# EasyEDA Pro project Water.epro

# Schematic Schematic1
Board Name: Board1; Create Date: 2026-02-25; Page Name: P1; Project Name: Water; Schematic Name: Schematic1; Update Date: 2026-02-25; Company: EasyEDA.com; Page Size: A4; Version: V1.0
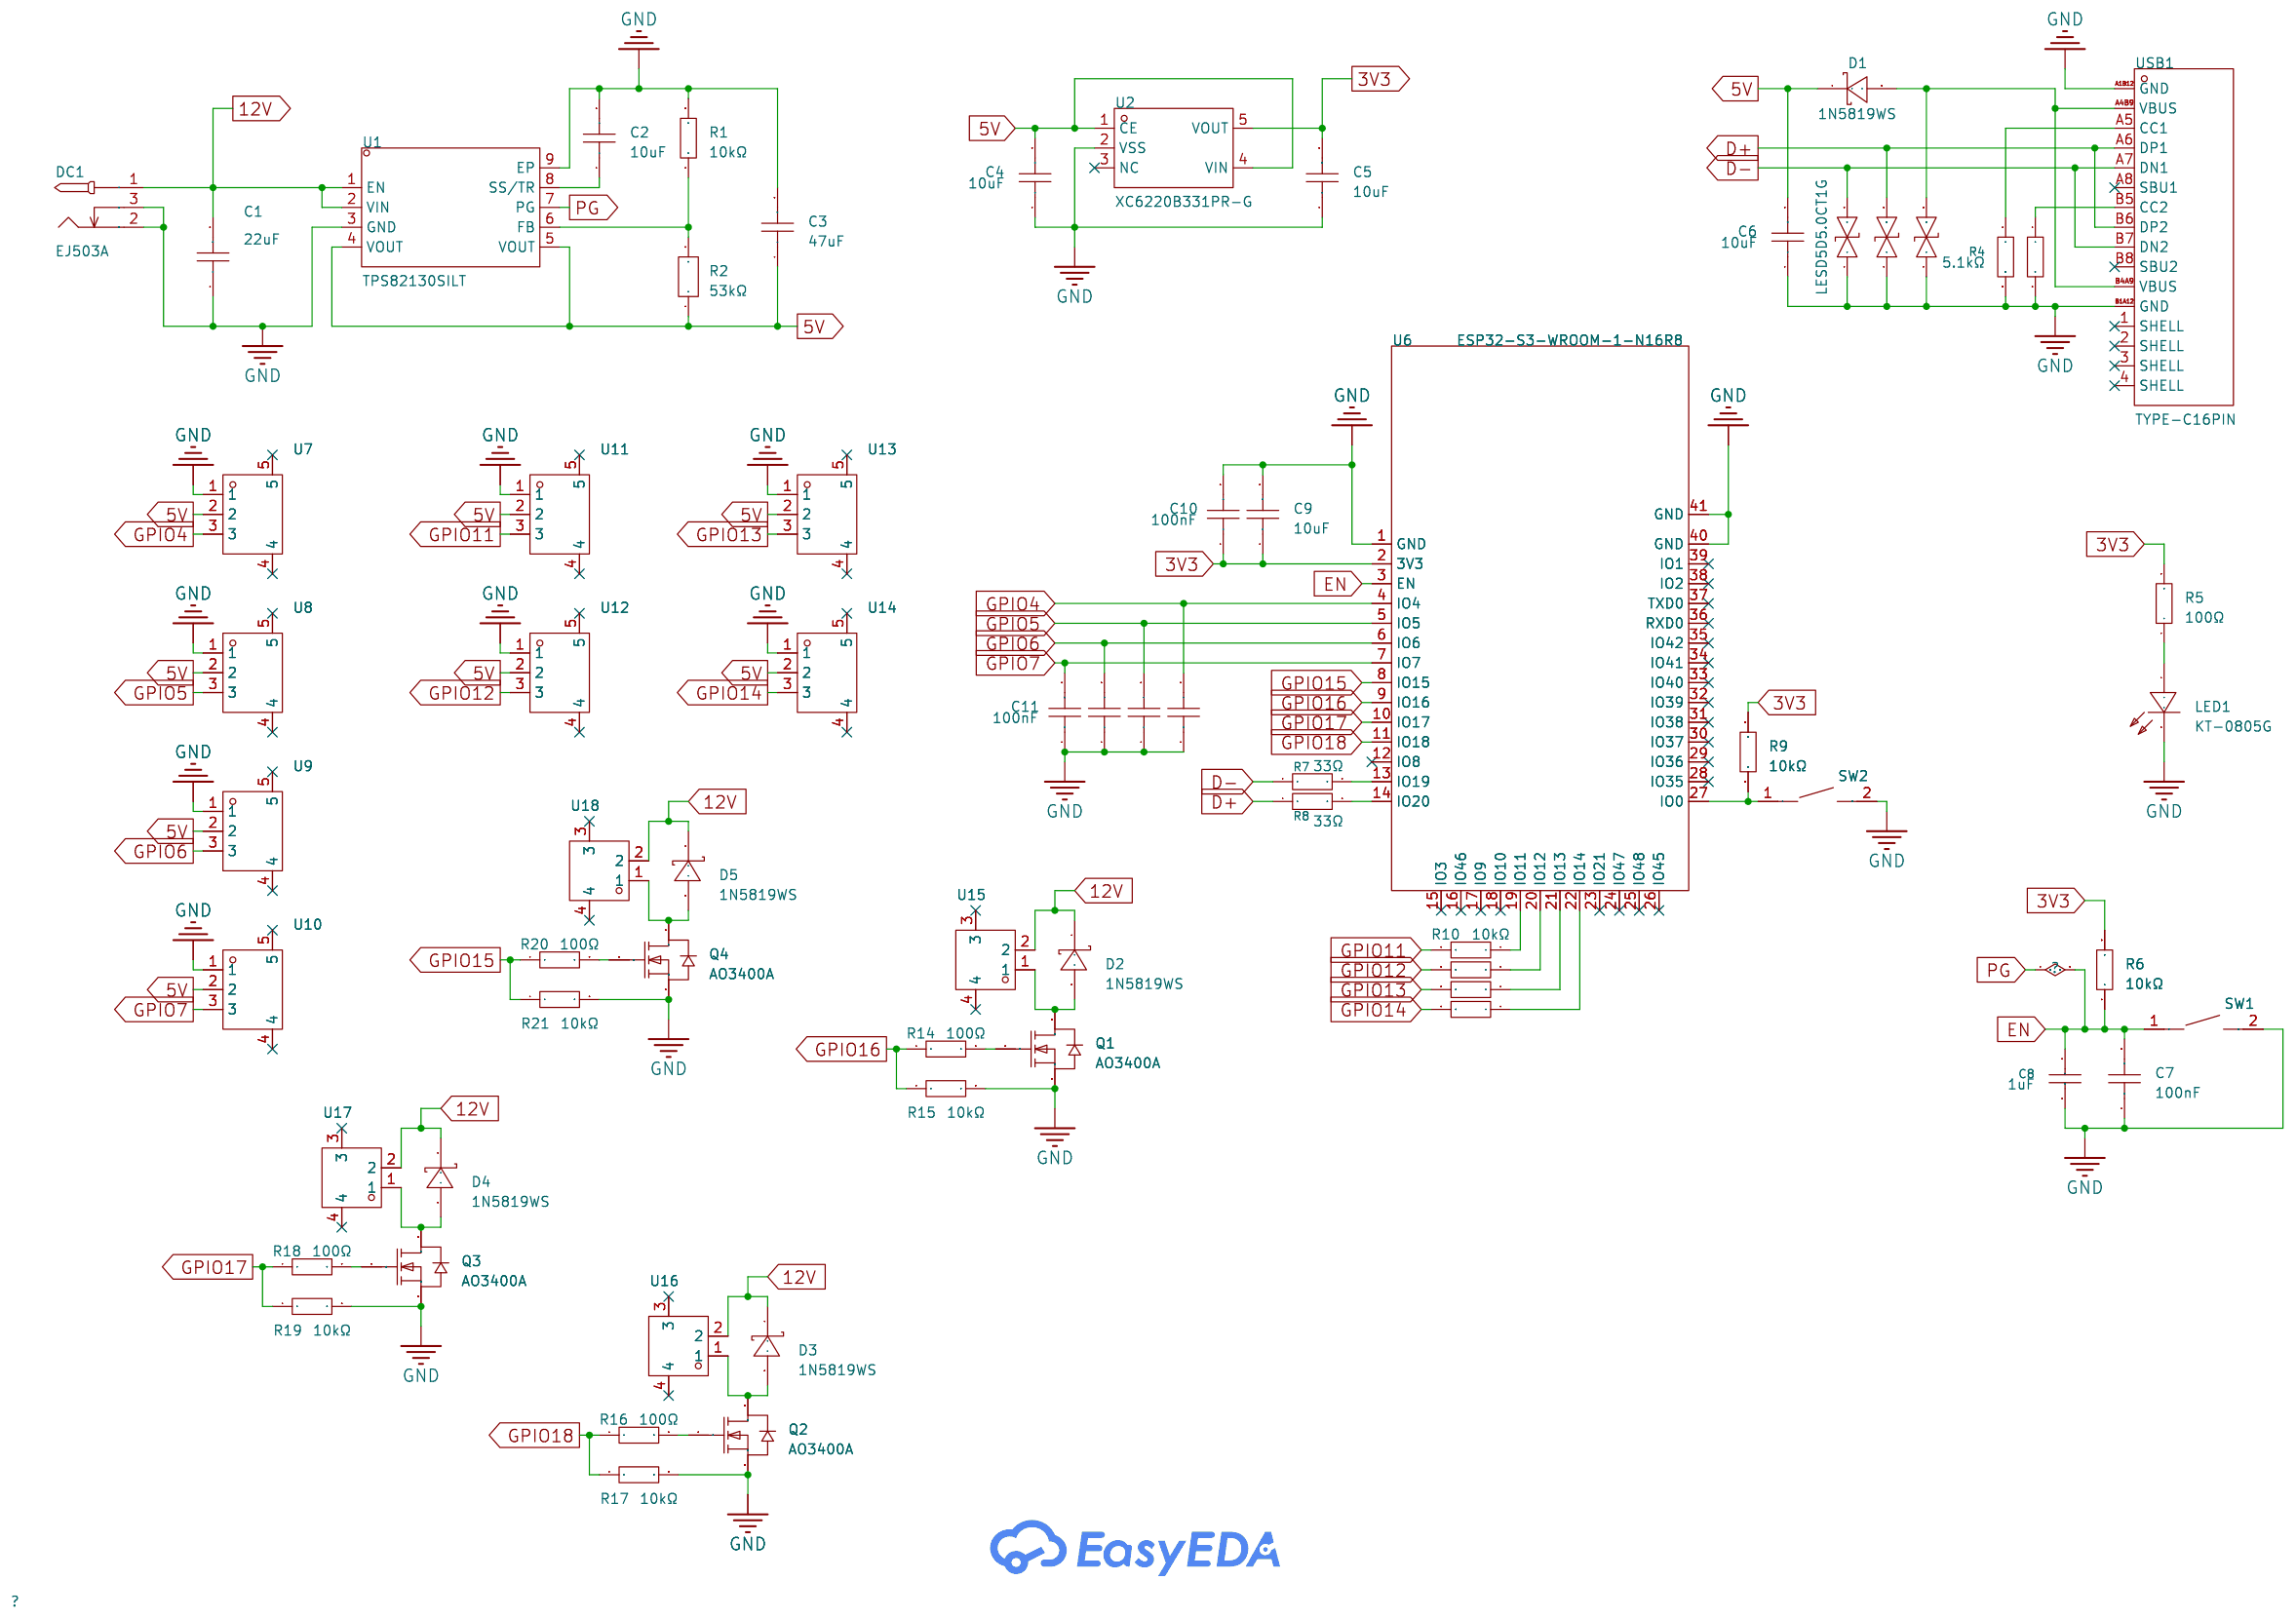
[diagram p0: schematic sheet]

## Parts
C1  22uF  [C1210]
C2  10uF  [C1210]
C3  47uF  [C1210]
C4  10uF  [C1210]
C5  10uF  [C1210]
C6  10uF  [C1210]
C7  100nF  [C0402]
C8  1uF  [C0805]
C9  10uF  [C1210]
C10  100nF  [C0402]
C11  100nF  [C0402]
C12  100nF  [C0402]
C13  100nF  [C0402]
C14  100nF  [C0402]
D1  1N5819WS  [SOD-323_L1.8-W1.3-LS2.5-RD]
D2  1N5819WS  [SOD-323_L1.8-W1.3-LS2.5-RD]
D3  1N5819WS  [SOD-323_L1.8-W1.3-LS2.5-RD]
D4  1N5819WS  [SOD-323_L1.8-W1.3-LS2.5-RD]
D5  1N5819WS  [SOD-323_L1.8-W1.3-LS2.5-RD]
DC1  EJ503A  [DC-IN-TH_EJ503A]
LED1  KT-0805G  [LED0805-R-RD]
Q1  AO3400A  [SOT-23-3_L2.9-W1.3-P1.90-LS2.4-BR]
Q2  AO3400A  [SOT-23-3_L2.9-W1.3-P1.90-LS2.4-BR]
Q3  AO3400A  [SOT-23-3_L2.9-W1.3-P1.90-LS2.4-BR]
Q4  AO3400A  [SOT-23-3_L2.9-W1.3-P1.90-LS2.4-BR]
R1  10kΩ  [R0402]
R2  53kΩ  [R0402]
R3  5.1kΩ  [R0402]
R4  5.1kΩ  [R0402]
R5  100Ω  [R0402]
R6  10kΩ  [R0402]
R7  33Ω  [R0402]
R8  33Ω  [R0402]
R9  10kΩ  [R0402]
R10  10kΩ  [R0402]
R11  10kΩ  [R0402]
R12  10kΩ  [R0402]
R13  10kΩ  [R0402]
R14  100Ω  [R0402]
R15  10kΩ  [R0402]
R16  100Ω  [R0402]
R17  10kΩ  [R0402]
R18  100Ω  [R0402]
R19  10kΩ  [R0402]
R20  100Ω  [R0402]
R21  10kΩ  [R0402]
SW1  TS-1088-AR02016  [SW-SMD_L3.9-W3.0-P4.45]
SW2  TS-1088-AR02016  [SW-SMD_L3.9-W3.0-P4.45]
U1  TPS82130SILT  [SIL-8_L3.0-W2.8-P0.65-BL-EP]
U2  XC6220B331PR-G  [SOT-89-5_L4.5-W2.5-P1.50-LS4.4-BR]
U3  LESD5D5.0CT1G  [SOD-523_L1.2-W0.8-LS1.6-BI]
U4  LESD5D5.0CT1G  [SOD-523_L1.2-W0.8-LS1.6-BI]
U5  LESD5D5.0CT1G  [SOD-523_L1.2-W0.8-LS1.6-BI]
U6  ESP32-S3-WROOM-1-N16R8  [WIRELM-SMD_ESP32-S3-WROOM-1]
U7  WAFER-PH2.0-3PLB  [CONN-SMD_3P-P2.00_XUNPU_WAFER-PH2.0-3PLB]
U8  WAFER-PH2.0-3PLB  [CONN-SMD_3P-P2.00_XUNPU_WAFER-PH2.0-3PLB]
U9  WAFER-PH2.0-3PLB  [CONN-SMD_3P-P2.00_XUNPU_WAFER-PH2.0-3PLB]
U10  WAFER-PH2.0-3PLB  [CONN-SMD_3P-P2.00_XUNPU_WAFER-PH2.0-3PLB]
U11  WAFER-PH2.0-3PLB  [CONN-SMD_3P-P2.00_XUNPU_WAFER-PH2.0-3PLB]
U12  WAFER-PH2.0-3PLB  [CONN-SMD_3P-P2.00_XUNPU_WAFER-PH2.0-3PLB]
U13  WAFER-PH2.0-3PLB  [CONN-SMD_3P-P2.00_XUNPU_WAFER-PH2.0-3PLB]
U14  WAFER-PH2.0-3PLB  [CONN-SMD_3P-P2.00_XUNPU_WAFER-PH2.0-3PLB]
U15  WAFER-PH2.0-2PLB  [CONN-TH_2P-P2.00_XUNPU_WAFER-PH2.0-2PLB]
U16  WAFER-PH2.0-2PLB  [CONN-TH_2P-P2.00_XUNPU_WAFER-PH2.0-2PLB]
U17  WAFER-PH2.0-2PLB  [CONN-TH_2P-P2.00_XUNPU_WAFER-PH2.0-2PLB]
U18  WAFER-PH2.0-2PLB  [CONN-TH_2P-P2.00_XUNPU_WAFER-PH2.0-2PLB]
USB1  TYPE-C16PIN  [USB-C-SMD_TYPE-C16PIN]

## Library data of the parts
C1 = CL32B226KAJNNNE: Capacitance:22uF Tolerance:±10% Tolerance:±10% Voltage Rating:25V Temperature Coefficient:X7R; LCSC Part Name: 22uF ±10% 25V; Supplier Part: C309062; Manufacturer: SAMSUNG(三星); Supplier Footprint: 1210; JLCPCB Part Class: Extended Part; Datasheet: https://item.szlcsc.com/datasheet/CL32B226KAJNNNE/292813.html; Supplier: LCSC; Tolerance: ±10%; Voltage Rating: 25V; Temperature Coefficient: X7R
C2 C4-C6 C9 = CL32Y106KCJ6PJE: Capacitance:10uF Tolerance:±10% Tolerance:±10% Voltage Rating:100V Temperature Coefficient:X7S; LCSC Part Name: 10uF ±10% 100V; Supplier Part: C22380041; Manufacturer: SAMSUNG(三星); Supplier Footprint: 1210; JLCPCB Part Class: Extended Part; Datasheet: https://item.szlcsc.com/datasheet/CL32Y106KCJ6PJE/23910233.html; Supplier: LCSC; Tolerance: ±10%; Voltage Rating: 100V; Temperature Coefficient: X7S
C3 = CL32B476KPJNNWE: Capacitance:47uF Tolerance:±10% Tolerance:±10% Voltage Rating:10V Temperature Coefficient:X7R; LCSC Part Name: 47uF ±10% 10V; Supplier Part: C2932479; Manufacturer: SAMSUNG(三星); Supplier Footprint: 1210; JLCPCB Part Class: Extended Part; Datasheet: https://item.szlcsc.com/datasheet/CL32B476KPJNNWE/3277792.html; Supplier: LCSC; Tolerance: ±10%; Voltage Rating: 10V; Temperature Coefficient: X7R
C7 C10-C14 = CL05B104KB54PNC: Capacitance:100nF Tolerance:±10% Tolerance:±10% Voltage Rating:50V Temperature Coefficient:X7R; LCSC Part Name: 100nF ±10% 50V; Supplier Part: C307331; Manufacturer: SAMSUNG(三星); Supplier Footprint: 0402; JLCPCB Part Class: Basic Part; Datasheet: https://item.szlcsc.com/datasheet/CL05B104KB54PNC/291005.html; Supplier: LCSC; Tolerance: ±10%; Voltage Rating: 50V; Temperature Coefficient: X7R
C8 = CL21B105KBFNNNE: Capacitance:1uF Tolerance:±10% Tolerance:±10% Voltage Rating:50V Temperature Coefficient:X7R; LCSC Part Name: 1uF ±10% 50V; Supplier Part: C28323; Manufacturer: SAMSUNG(三星); Supplier Footprint: 0805; JLCPCB Part Class: Basic Part; Datasheet: https://item.szlcsc.com/datasheet/CL21B105KBFNNNE/29074.html; Supplier: LCSC; Tolerance: ±10%; Voltage Rating: 50V; Temperature Coefficient: X7R
D1-D5 = 1N5819WS_C191023: Voltage - Forward(Vf@If):600mV@1A Voltage - DC Reverse(Vr):40V Current - Rectified:1A Non-Repetitive Peak Forward Surge Current:25A; LCSC Part Name: 电压:40V 电流:1A; Supplier Part: C191023; Manufacturer: Hottech(合科泰); Supplier Footprint: SOD-323; JLCPCB Part Class: Basic Part; Datasheet: https://item.szlcsc.com/datasheet/1N5819WS/213850.html; Supplier: LCSC; Voltage - Forward(Vf@If): 600mV@1A; Voltage - DC Reverse(Vr): 40V; Current - Rectified: 1A; Non-Repetitive Peak Forward Surge Current: 25A
DC1 = EJ503A: Inside Contact Diameter:2.1mm Outside Contact Diameter:5.5mm Current Rating:5A Voltage Rating (Max):12V Operating Temperature:-15℃~+90℃ Operating Temperature:-15℃~+90℃; LCSC Part Name: 内径:2.1mm 外径:5.5mm; Supplier Part: C3095117; Manufacturer: MPD(Memory Protection Devices); Supplier Footprint: 插件; JLCPCB Part Class: Extended Part; Datasheet: https://item.szlcsc.com/datasheet/EJ503A/3654351.html; Supplier: LCSC; Inside Contact Diameter: 2.1mm; Outside Contact Diameter: 5.5mm; Current Rating: 5A; Voltage Rating (Max): 12V; Operating Temperature: -15℃~+90℃
LED1 = KT-0805G: Lamp Holder Type:- Illumination Color:Emerald Green Voltage - Forward(Vf):2.6V~3.1V Voltage - Forward(Vf):2.6V~3.1V Power(Watts):100mW Forward Current:5mA Wavelength - Dominant:513nm~528nm Wavelength - Dominant:513nm~528nm Peak Wavelength:525nm Diode Conf; LCSC Part Name: 0805 翠绿 高亮; Supplier Part: C2297; Manufacturer: KENTO; Supplier Footprint: 0805; JLCPCB Part Class: Basic Part; Datasheet: https://item.szlcsc.com/datasheet/KT-0805G/2670.html; Supplier: LCSC; Illumination Color: Emerald Green; Voltage - Forward(Vf): 2.6V~3.1V; Power(Watts): 100mW; Forward Current: 5mA; Wavelength - Dominant: 513nm~528nm; Peak Wavelength: 525nm; Luminous Intensity: 430mcd; Viewing Angle: 120°; Operating Temperature: -40℃~+85℃
Q1-Q4 = AO3400A_C20917: Number:- Drain to Source Voltage:30V Current - Continuous Drain(Id):- RDS(on):48mΩ@2.5V Pd - Power Dissipation:- Gate Threshold Voltage (Vgs(th)):1.45V@250uA Gate Charge(Qg):7nC@10V Input Capacitance(Ciss):630pF@15V Reverse Transfer Capacitance (Crss@Vds); LCSC Part Name: 1个N沟道 耐压:30V 电流:5.7A; Supplier Part: C20917; Manufacturer: AOS; Supplier Footprint: SOT-23-3L; JLCPCB Part Class: Basic Part; Datasheet: https://item.szlcsc.com/datasheet/AO3400A/21629.html; Supplier: LCSC; Drain to Source Voltage: 30V; RDS(on): 48mΩ@2.5V; Gate Threshold Voltage (Vgs(th)): 1.45V@250uA; Gate Charge(Qg): 7nC@10V; Input Capacitance(Ciss): 630pF@15V; Operating Temperature: -55℃~+150℃@(Tj); Type: N-Channel
R1 R6 R9-R13 R15 R17 R19 R21 = 0402WGF1002TCE: Type:Thick Film Resistor Resistance:10kΩ Tolerance:±1% Tolerance:±1% Power(Watts):62.5mW Voltage-Supply(Max):50V Temperature Coefficient:±100ppm/℃ Temperature Coefficient:±100ppm/℃ Operating Temperature:-55℃~+155℃ Operating Temperature:-55℃~+155℃; LCSC Part Name: 10kΩ ±1% 62.5mW 厚膜电阻; Supplier Part: C25744; Manufacturer: UNI-ROYAL(厚声); Supplier Footprint: 0402; JLCPCB Part Class: Basic Part; Datasheet: https://item.szlcsc.com/datasheet/0402WGF1002TCE/26487.html; Supplier: LCSC; Type: Thick Film Resistor; Tolerance: ±1%; Power(Watts): 62.5mW; Voltage-Supply(Max): 50V; Temperature Coefficient: ±100ppm/℃; Operating Temperature: -55℃~+155℃
R2 = RT0402BRD0753KL: Type:Thin Film Resistor Resistance:53kΩ Tolerance:±0.1% Tolerance:±0.1% Power(Watts):62.5mW Temperature Coefficient:±25ppm/℃ Temperature Coefficient:±25ppm/℃ Operating Temperature:-55℃~+155℃ Operating Temperature:-55℃~+155℃; LCSC Part Name: 薄膜电阻 53kΩ ±0.1% 62.5mW; Supplier Part: C852836; Manufacturer: YAGEO(国巨); Supplier Footprint: 0402; JLCPCB Part Class: Extended Part; Datasheet: https://item.szlcsc.com/datasheet/RT0402BRD0753KL/913158.html; Supplier: LCSC; Type: Thin Film Resistor; Tolerance: ±0.1%; Power(Watts): 62.5mW; Temperature Coefficient: ±25ppm/℃; Operating Temperature: -55℃~+155℃
R3 R4 = 0402WGF5101TCE: Type:Thick Film Resistor Resistance:5.1kΩ Tolerance:±1% Tolerance:±1% Power(Watts):62.5mW Voltage-Supply(Max):50V Temperature Coefficient:±100ppm/℃ Temperature Coefficient:±100ppm/℃ Operating Temperature:-55℃~+155℃ Operating Temperature:-55℃~+155℃; LCSC Part Name: 5.1kΩ ±1% 62.5mW 厚膜电阻; Supplier Part: C25905; Manufacturer: UNI-ROYAL(厚声); Supplier Footprint: 0402; JLCPCB Part Class: Basic Part; Datasheet: https://item.szlcsc.com/datasheet/0402WGF5101TCE/26648.html; Supplier: LCSC; Type: Thick Film Resistor; Tolerance: ±1%; Power(Watts): 62.5mW; Voltage-Supply(Max): 50V; Temperature Coefficient: ±100ppm/℃; Operating Temperature: -55℃~+155℃
R5 R14 R16 R18 R20 = 0402WGF1000TCE: Type:Thick Film Resistors Resistance: Tolerance:±1% Tolerance:±1% Power(Watts): Overload Voltage (Max): Temperature Coefficient:±200ppm/℃ Temperature Coefficient:±200ppm/℃ Operating Temperature Range:-55℃~+155℃ Operating Temperature Range:-55℃~+155℃; LCSC Part Name: 100Ω ±1% 62.5mW 厚膜电阻; Supplier Part: C25076; Manufacturer: UNI-ROYAL(厚声); Supplier Footprint: 0402; JLCPCB Part Class: Basic Part; Datasheet: https://atta.szlcsc.com/upload/public/pdf/source/20200306/C422600_1E6D84923E4A46A82E41ADD87F860B5C.pdf; Supplier: LCSC; Type: Thick Film Resistors; Tolerance: ±1%; Temperature Coefficient: ±200ppm/℃; Operating Temperature Range: -55℃~+155℃
R7 R8 = 0402WGF330JTCE: Type:Thick Film Resistor Resistance:33Ω Tolerance:±1% Tolerance:±1% Power(Watts):62.5mW Voltage-Supply(Max):50V Temperature Coefficient:±100ppm/℃ Temperature Coefficient:±100ppm/℃ Operating Temperature:-55℃~+155℃ Operating Temperature:-55℃~+155℃; LCSC Part Name: 33Ω ±1% 62.5mW 厚膜电阻; Supplier Part: C25105; Manufacturer: UNI-ROYAL(厚声); Supplier Footprint: 0402; JLCPCB Part Class: Basic Part; Datasheet: https://item.szlcsc.com/datasheet/0402WGF330JTCE/25848.html; Supplier: LCSC; Type: Thick Film Resistor; Tolerance: ±1%; Power(Watts): 62.5mW; Voltage-Supply(Max): 50V; Temperature Coefficient: ±100ppm/℃; Operating Temperature: -55℃~+155℃
SW1 SW2 = TS-1088-AR02016: Circuit:SPST Actuator Style:Round Button Operating Force:1.6N Mounting Type:Surface Mount,Vertical Length:4mm Width:3mm Switch Height:2mm with Bracket:Without Bracket Contact Current:50mA Voltage Rating:12V Actuator/Cap Color:Black Termination Style:SMD(S; LCSC Part Name: 4*3*2mm 立贴 轻触开关; Supplier Part: C720477; Manufacturer: XUNPU(讯普); Supplier Footprint: SMD,4x3mm; JLCPCB Part Class: Basic Part; Datasheet: https://item.szlcsc.com/datasheet/TS-1088-AR02016/763484.html; Supplier: LCSC; Circuit: SPST; Actuator Style: Round Button; Operating Force: 1.6N; Mounting Type: Surface Mount,Vertical; Length: 4mm; Width: 3mm; Switch Height: 2mm; with Bracket: Without Bracket; Contact Current: 50mA; Voltage Rating: 12V; Actuator/Cap Color: Black; Termination Style: SMD(SMT) Tab; Life: 100,000 Cycles; Operating Temperature: -30℃~+80℃
U1 = TPS82130SILT: Function:Buck Number of Outputs:1 Voltage - Supply:3V~17V Voltage - Supply:3V~17V Output Voltage:900mV~6V Output Voltage:900mV~6V Output Current(Max):3A Output Current(Max):3A Quiescent Supply Current:20uA Switching Frequency:2MHz Ripple Noise:20mVp-p Fea; LCSC Part Name: 17V输入、3A降压转换器MicroSiP模块; Supplier Part: C163210; Manufacturer: TI(德州仪器); Supplier Footprint: SMD-8; JLCPCB Part Class: Extended Part; Datasheet: https://www.ti.com/cn/lit/gpn/tps82130; Supplier: LCSC; Function: Buck; Number of Outputs: 1; Voltage - Supply: 3V~17V; Output Voltage: 900mV~6V; Output Current(Max): 3A; Quiescent Supply Current: 20uA; Switching Frequency: 2MHz; Ripple Noise: 20mVp-p; Features: Over Temperature Protection; Length: 3mm; Width: 2.8mm; Height: 1.5mm; Operating Temperature Range: -40℃~+125℃
U2 = XC6220B331PR-G: Output Type:Fixed Voltage - Supply:6V Output Voltage:3.3V Output Voltage:3.3V Output Current:1A Power Supply Rejection Ratio (PSRR):50dB@(1kHz) Voltage Dropout:655mV@(1A) standby current:18uA Features:Surge Protection；Short-Circuit  Protection；Automatic D; LCSC Part Name: 带\"GO\"功能的1A高速LDO电压稳压器; Supplier Part: C3013658; Manufacturer: TOREX(特瑞仕); Supplier Footprint: SOT-89-5; JLCPCB Part Class: Extended Part; Datasheet: https://atta.szlcsc.com/upload/public/pdf/source/20220511/F1132B42A1D8E465E8536D59E138453A.pdf; Supplier: LCSC; Output Type: Fixed; Voltage - Supply: 6V; Output Voltage: 3.3V; Output Current: 1A; Power Supply Rejection Ratio (PSRR): 50dB@(1kHz); Voltage Dropout: 655mV@(1A); standby current: 18uA; Features: Surge Protection；Short-Circuit  Protection；Automatic Discharge Function；Low ESR；Thermal Protection(TSD)；Overcurrent Protection(OCP)；With ability; Operating Temperature: -40℃~+85℃; Output Configuration: Positive electrode; Number of Outputs: 1
U3-U5 = LESD5D5.0CT1G_C5246195: Supplier Part: C5246195; Manufacturer: Leiditech(雷卯电子); Supplier Footprint: SOD-523; JLCPCB Part Class: Extended Part; Datasheet: https://atta.szlcsc.com/upload/public/pdf/source/20221108/1C42B36F7D16189BC2911DA9C8277455.pdf; Supplier: LCSC
U6 = ESP32-S3-WROOM-1-N16R8: LCSC Part Name: 通用型Wi-Fi+低功耗蓝牙MCU模组; Supplier Part: C2913202; Manufacturer: ESPRESSIF(乐鑫); Supplier Footprint: SMD,25.5x18mm; JLCPCB Part Class: Extended Part; Datasheet: https://item.szlcsc.com/datasheet/ESP32-S3-WROOM-1-N16R8/3198300.html; Supplier: LCSC
U7-U14 = WAFER-PH2.0-3PLB: Pins Structure:1x3P Pitch:2mm Mounting Type:Surface Mount,Vertical Reference Series:PH Number of Pins:3P Number of Rows:1 Number of PINs Per Row:3 Row Spacing:- Current Rating:2A Contact Material:Brass Contact Plating:Tin Operating Temperature:-25℃~+85℃ O; LCSC Part Name: 1x3P 间距:2mm 立贴 系列:PH; Supplier Part: C3029432; Manufacturer: XUNPU(讯普); Supplier Footprint: SMD,P=2mm; JLCPCB Part Class: Extended Part; Datasheet: https://item.szlcsc.com/datasheet/WAFER-PH2.0-3PLB/3561444.html; Supplier: LCSC; Pins Structure: 1x3P; Pitch: 2mm; Mounting Type: Surface Mount,Vertical; Reference Series: PH; Number of Pins: 3P; Number of Rows: 1; Number of PINs Per Row: 3; Current Rating: 2A; Contact Material: Brass; Contact Plating: Tin; Operating Temperature: -25℃~+85℃; Voltage Rating: 250V; Plastic Material: LCP; Supplementary Features: Auxiliary Solder Pin; Color: Beige; Z-Height of the Board: 6.2mm; X-Length of Bottom Edge on Board (Spacing Line): 10mm; Y-Width of Bottom Edge on Board: 5.45mm
U15-U18 = WAFER-PH2.0-2PLB: Pins Structure:1x2P Pitch:2mm Mounting Type:Surface Mount,Vertical Reference Series:PH Number of Pins:2P Number of Rows:1 Number of PINs Per Row:2 Row Spacing:- Current Rating:2A Contact Material:Brass Contact Plating:Tin Operating Temperature:-25℃~+85℃ O; LCSC Part Name: 1x2P 间距:2mm 立贴 系列:PH; Supplier Part: C3029431; Manufacturer: XUNPU(讯普); Supplier Footprint: SMD,P=2mm; JLCPCB Part Class: Extended Part; Datasheet: https://item.szlcsc.com/datasheet/WAFER-PH2.0-2PLB/3561443.html; Supplier: LCSC; Pins Structure: 1x2P; Pitch: 2mm; Mounting Type: Surface Mount,Vertical; Reference Series: PH; Number of Pins: 2P; Number of Rows: 1; Number of PINs Per Row: 2; Current Rating: 2A; Contact Material: Brass; Contact Plating: Tin; Operating Temperature: -25℃~+85℃; Voltage Rating: 250V; Plastic Material: LCP; Supplementary Features: Auxiliary Solder Pin; Color: Beige; Z-Height of the Board: 6.2mm; X-Length of Bottom Edge on Board (Spacing Line): 8mm; Y-Width of Bottom Edge on Board: 5.45mm
USB1 = TYPE-C16PIN: Connector Type:Type-C Protocol Standard:- Gender:Female Mounting Type:Surface Mount, Right Angle Number of Contacts:16P Number of Ports:1 Current Rating-Power:3A Voltage Rating:30V Connect-Disconnect Life:10,000 Cycles Supplementary Features:- Center Heig; LCSC Part Name: 16P卧贴母座; Supplier Part: C393939; Manufacturer: SHOU HAN(首韩); Supplier Footprint: SMD; JLCPCB Part Class: Extended Part; Datasheet: https://item.szlcsc.com/datasheet/TYPE-C16PIN/372551.html; Supplier: LCSC; Connector Type: Type-C; Gender: Female; Mounting Type: Surface Mount, Right Angle; Number of Contacts: 16P; Number of Ports: 1; Current Rating-Power: 3A; Voltage Rating: 30V; Connect-Disconnect Life: 10,000 Cycles; Detection color: Black; Operating Temperature: -40℃~+85℃

## Nets
3V3: C5.2 C9.1 C10.1 R5.2 R6.2 R9.2 U2.5(VOUT) U6.2(3V3)
5V: C3.1 C4.2 C6.2 D1.1(K) R2.1 U1.4(VOUT) U1.5(VOUT) U2.1(CE) U2.4(VIN) U7.2 U8.2 U9.2 U10.2 U11.2 U12.2 U13.2 U14.2
12V: C1.2 D2.1(K) D3.1(K) D4.1(K) D5.1(K) DC1.1 U1.1(EN) U1.2(VIN) U15.2 U16.2 U17.2 U18.2
GND: C1.1 C2.2 C3.2 C4.1 C5.1 C6.1 C7.1 C8.1 C9.2 C10.2 C11.1 C12.1 C13.1 C14.1 DC1.2 DC1.3 LED1.2(K) Q1.2(S) Q2.2(S) Q3.2(S) Q4.2(S) R1.2 R3.2 R4.2 R15.2 R17.2 R19.2 R21.2 SW1.2 SW2.2 U1.3(GND) U1.9(EP) U2.2(VSS) U3.1 U4.1 U5.1 U6.1(GND) U6.40(GND) U6.41(GND) U7.1 U8.1 U9.1 U10.1 U11.1 U12.1 U13.1 U14.1 USB1.A1B12(GND) USB1.B1A12(GND)
D+: R8.1 U4.2 USB1.A6(DP1) USB1.B6(DP2)
D-: R7.1 U5.2 USB1.A7(DN1) USB1.B7(DN2)
EN: C7.2 C8.2 R6.1 SW1.1 U1.7(PG) U6.3(EN)
GPIO4: C14.2 U6.4(IO4) U7.3
GPIO5: C13.2 U6.5(IO5) U8.3
GPIO6: C12.2 U6.6(IO6) U9.3
GPIO7: C11.2 U6.7(IO7) U10.3
GPIO11: R10.2 U11.3
GPIO12: R11.2 U12.3
GPIO13: R12.2 U13.3
GPIO14: R13.2 U14.3
GPIO15: R20.1 R21.1 U6.8(IO15)
GPIO16: R14.1 R15.1 U6.9(IO16)
GPIO17: R18.1 R19.1 U6.10(IO17)
GPIO18: R16.1 R17.1 U6.11(IO18)
$1N755: C2.1 U1.8(SS/TR)
$1N917: R1.1 R2.2 U1.6(FB)
$1N2096: R3.1 USB1.B5(CC2)
$1N2140: R4.1 USB1.A5(CC1)
$1N2406: D1.2(A) U3.2 USB1.A4B9(VBUS) USB1.B4A9(VBUS)
$1N2868: LED1.1(A) R5.1
$1N3816: R8.2 U6.14(IO20)
$1N3820: R7.2 U6.13(IO19)
$1N4148: R9.1 SW2.1 U6.27(IO0)
$1N4709: R10.1 U6.19(IO11)
$1N4843: R11.1 U6.20(IO12)
$1N4849: R12.1 U6.21(IO13)
$1N4855: R13.1 U6.22(IO14)
$1N6055: D2.2(A) Q1.3(D) U15.1
$1N6201: Q1.1(G) R14.2
$1N6555: D3.2(A) Q2.3(D) U16.1
$1N6563: Q2.1(G) R16.2
$1N7088: D4.2(A) Q3.3(D) U17.1
$1N7096: Q3.1(G) R18.2
$1N7356: D5.2(A) Q4.3(D) U18.1
$1N7364: Q4.1(G) R20.2

Not connected (* = marked no-connect by the designer): U2 3(NC)*; U6 12(IO8)* 15(IO3)* 16(IO46)* 17(IO9)* 18(IO10)* 23(IO21)* 24(IO47)* 25(IO48)* 26(IO45)* 28(IO35)* 29(IO36)* 30(IO37)* 31(IO38)* 32(IO39)* 33(IO40)* 34(IO41)* 35(IO42)* 36(RXD0)* 37(TXD0)* 38(IO2)* 39(IO1)*; U7 4* 5*; U8 4* 5*; U9 4* 5*; U10 4* 5*; U11 4* 5*; U12 4* 5*; U13 4* 5*; U14 4* 5*; U15 3* 4*; U16 3* 4*; U17 3* 4*; U18 3* 4*; USB1 1(SHELL)* 2(SHELL)* 3(SHELL)* 4(SHELL)* A8(SBU1)* B8(SBU2)*

# Board PCB1
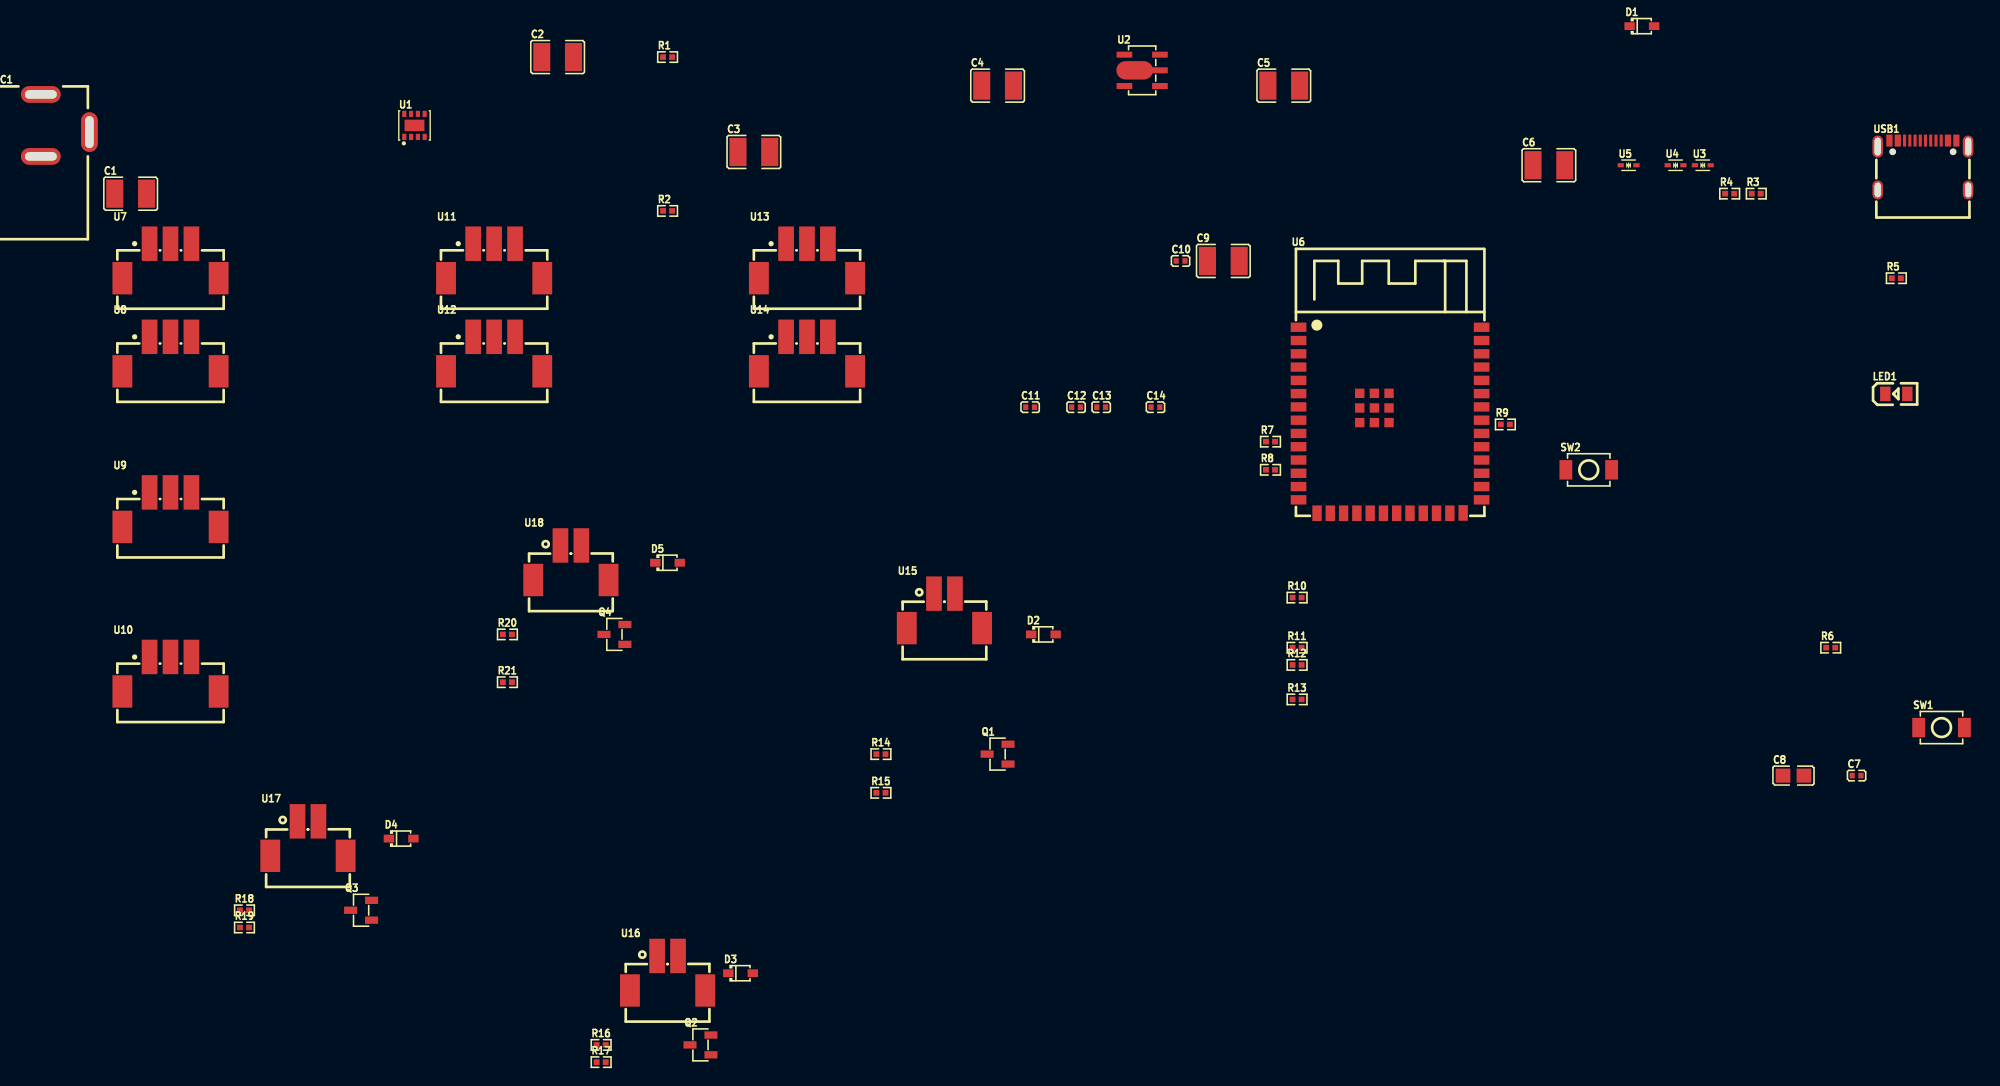
[diagram p1: board, top side]
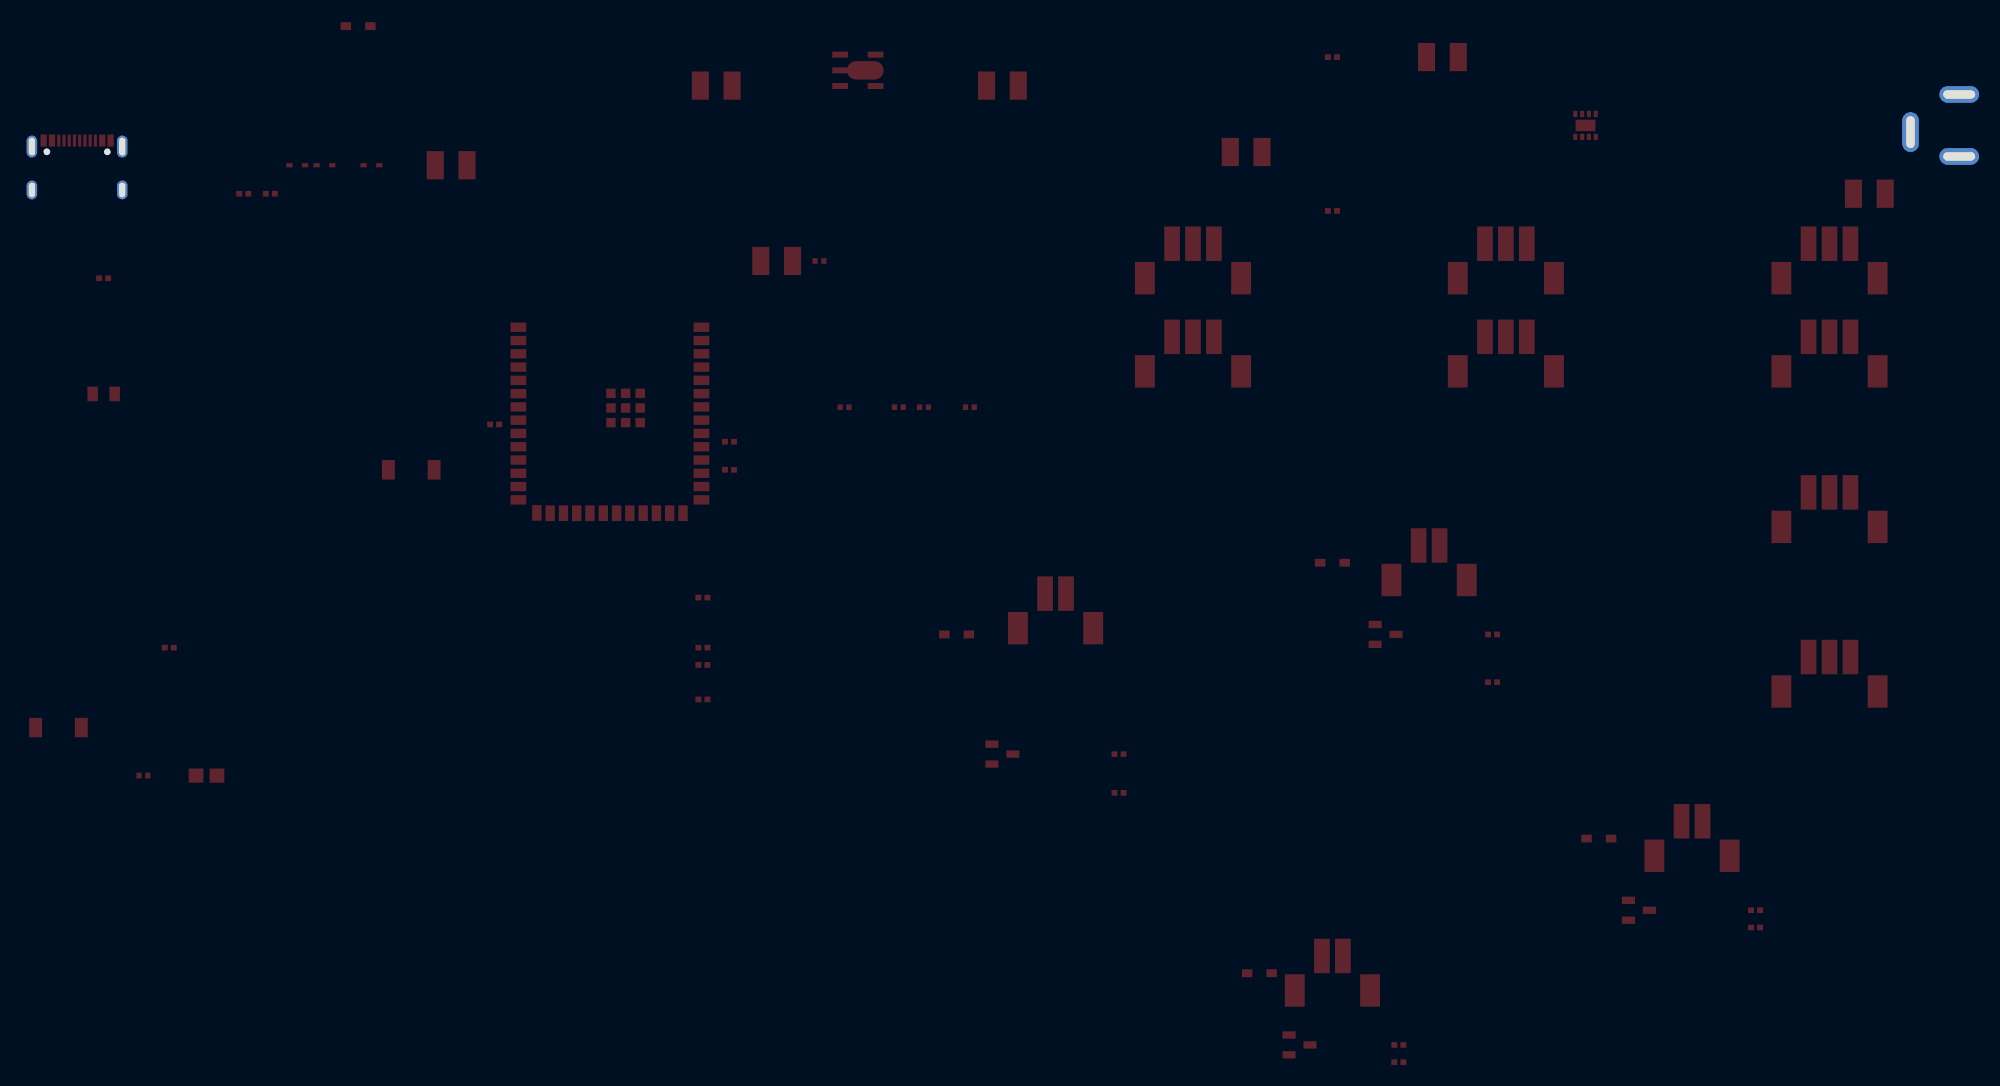
[diagram p2: board, bottom side, seen from below]

Outline 6.42 x 0.64 mm; copper layers: Top Layer, Bottom Layer. Coordinates in mm from the lower left corner of the outline.
Stack: Top Layer 0.035mm / Dielectric1 1.51mm FR4 er 4.5 / Bottom Layer 0.035mm

## Design rules (mm)
template: JLCPCB Capability(Two Layers Board)
spacing copperThickness1oz (default): track to track 0.102, other pairs 0.152 to 0.3
spacing copperThickness2oz: track to track 0.203, other pairs 0.152 to 0.3
track width copperThickness1oz (default): min 0.127, default 0.254, max 2.54
track width copperThickness2oz: min 0.203, default 0.254, max 2.54
differential pair differentialPair (default): width min 0.127, default 0.254, max 2.54; gap min 0.152, default 0.152
via viaSize (default): diameter min 0.5, default 0.61, max 10; hole min 0.3, default 0.305, max 6.3

## Placement (name value [footprint] x y rotation side)
C1  22uF  [C1210]  -168.12 -3.69 0 top
C2  10uF  [C1210]  -127.3 9.38 0 top
C3  47uF  [C1210]  -108.55 0.3 0 top
C4  10uF  [C1210]  -85.24 6.65 0 top
C5  10uF  [C1210]  -57.88 6.65 0 top
C6  10uF  [C1210]  -32.54 -0.97 0 top
C7  100nF  [C0402]  -3.13 -59.35 0 top
C8  1uF  [C0805]  -9.16 -59.35 0 top
C9  10uF  [C1210]  -63.66 -10.12 0 top
C10  100nF  [C0402]  -67.75 -10.12 0 top
C11  100nF  [C0402]  -82.13 -24.11 0 top
C12  100nF  [C0402]  -77.74 -24.11 0 top
C13  100nF  [C0402]  -75.34 -24.11 0 top
C14  100nF  [C0402]  -70.15 -24.11 0 top
D1  1N5819WS  [SOD-323_L1.8-W1.3-LS2.5-RD]  -23.65 12.34 0 top
D2  1N5819WS  [SOD-323_L1.8-W1.3-LS2.5-RD]  -80.86 -45.85 0 top
D3  1N5819WS  [SOD-323_L1.8-W1.3-LS2.5-RD]  -109.82 -78.26 0 top
D4  1N5819WS  [SOD-323_L1.8-W1.3-LS2.5-RD]  -142.26 -65.38 0 top
D5  1N5819WS  [SOD-323_L1.8-W1.3-LS2.5-RD]  -116.79 -38.99 0 top
DC1  EJ503A  [DC-IN-TH_EJ503A]  -174.39 2.84 0 top
LED1  KT-0805G  [LED0805-R-RD]  0.67 -22.84 0 top
Q1  AO3400A  [SOT-23-3_L2.9-W1.3-P1.90-LS2.4-BR]  -85.24 -57.3 0 top
Q2  AO3400A  [SOT-23-3_L2.9-W1.3-P1.90-LS2.4-BR]  -113.65 -85.12 0 top
Q3  AO3400A  [SOT-23-3_L2.9-W1.3-P1.90-LS2.4-BR]  -146.09 -72.24 0 top
Q4  AO3400A  [SOT-23-3_L2.9-W1.3-P1.90-LS2.4-BR]  -121.87 -45.85 0 top
R1  10kΩ  [R0402]  -116.79 9.38 0 top
R2  53kΩ  [R0402]  -116.79 -5.33 0 top
R3  5.1kΩ  [R0402]  -12.72 -3.69 0 top
R4  5.1kΩ  [R0402]  -15.26 -3.69 0 top
R5  100Ω  [R0402]  0.67 -11.77 0 top
R6  10kΩ  [R0402]  -5.6 -47.12 0 top
R7  33Ω  [R0402]  -59.15 -27.41 0 top
R8  33Ω  [R0402]  -59.15 -30.1 0 top
R9  10kΩ  [R0402]  -36.7 -25.76 0 top
R10  10kΩ  [R0402]  -56.61 -42.33 0 top
R11  10kΩ  [R0402]  -56.61 -47.12 0 top
R12  10kΩ  [R0402]  -56.61 -48.77 0 top
R13  10kΩ  [R0402]  -56.61 -52.07 0 top
R14  100Ω  [R0402]  -96.39 -57.3 0 top
R15  10kΩ  [R0402]  -96.39 -61 0 top
R16  100Ω  [R0402]  -123.14 -85.12 0 top
R17  10kΩ  [R0402]  -123.14 -86.77 0 top
R18  100Ω  [R0402]  -157.24 -72.24 0 top
R19  10kΩ  [R0402]  -157.24 -73.89 0 top
R20  100Ω  [R0402]  -132.1 -45.85 0 top
R21  10kΩ  [R0402]  -132.1 -50.42 0 top
SW1  TS-1088-AR02016  [SW-SMD_L3.9-W3.0-P4.45]  4.99 -54.76 0 top
SW2  TS-1088-AR02016  [SW-SMD_L3.9-W3.0-P4.45]  -28.73 -30.1 0 top
U1  TPS82130SILT  [SIL-8_L3.0-W2.8-P0.65-BL-EP]  -140.99 2.84 0 top
U2  XC6220B331PR-G  [SOT-89-5_L4.5-W2.5-P1.50-LS4.4-BR]  -71.42 8.11 0 top
U3  LESD5D5.0CT1G  [SOD-523_L1.2-W0.8-LS1.6-BI]  -17.83 -0.97 0 top
U4  LESD5D5.0CT1G  [SOD-523_L1.2-W0.8-LS1.6-BI]  -20.43 -0.97 0 top
U5  LESD5D5.0CT1G  [SOD-523_L1.2-W0.8-LS1.6-BI]  -24.92 -0.97 0 top
U6  ESP32-S3-WROOM-1-N16R8  [WIRELM-SMD_ESP32-S3-WROOM-1]  -47.72 -25.36 0 top
U7  WAFER-PH2.0-3PLB  [CONN-SMD_3P-P2.00_XUNPU_WAFER-PH2.0-3PLB]  -164.31 -10.12 0 top
U8  WAFER-PH2.0-3PLB  [CONN-SMD_3P-P2.00_XUNPU_WAFER-PH2.0-3PLB]  -164.31 -19.03 0 top
U9  WAFER-PH2.0-3PLB  [CONN-SMD_3P-P2.00_XUNPU_WAFER-PH2.0-3PLB]  -164.31 -33.91 0 top
U10  WAFER-PH2.0-3PLB  [CONN-SMD_3P-P2.00_XUNPU_WAFER-PH2.0-3PLB]  -164.31 -49.66 0 top
U11  WAFER-PH2.0-3PLB  [CONN-SMD_3P-P2.00_XUNPU_WAFER-PH2.0-3PLB]  -133.37 -10.12 0 top
U12  WAFER-PH2.0-3PLB  [CONN-SMD_3P-P2.00_XUNPU_WAFER-PH2.0-3PLB]  -133.37 -19.03 0 top
U13  WAFER-PH2.0-3PLB  [CONN-SMD_3P-P2.00_XUNPU_WAFER-PH2.0-3PLB]  -103.47 -10.12 0 top
U14  WAFER-PH2.0-3PLB  [CONN-SMD_3P-P2.00_XUNPU_WAFER-PH2.0-3PLB]  -103.47 -19.03 0 top
U15  WAFER-PH2.0-2PLB  [CONN-TH_2P-P2.00_XUNPU_WAFER-PH2.0-2PLB]  -90.32 -43.6 0 top
U16  WAFER-PH2.0-2PLB  [CONN-TH_2P-P2.00_XUNPU_WAFER-PH2.0-2PLB]  -116.79 -78.26 0 top
U17  WAFER-PH2.0-2PLB  [CONN-TH_2P-P2.00_XUNPU_WAFER-PH2.0-2PLB]  -151.17 -65.38 0 top
U18  WAFER-PH2.0-2PLB  [CONN-TH_2P-P2.00_XUNPU_WAFER-PH2.0-2PLB]  -126.03 -38.99 0 top
USB1  TYPE-C16PIN  [USB-C-SMD_TYPE-C16PIN]  3.21 -0.97 0 top

## Footprints (pads in the part's own frame, mm; a bottom-side part is the same pattern mirrored in y, then rotated)
C0402
  rect 0.5x0.54 smd: 1(-0.42,0) 2(0.42,0)
C0805
  rect 1.41x1.35 smd: 1(-1,0) 2(1,0)
C1210
  rect 1.635x2.7 smd: 1(-1.518,0) 2(1.518,0)
CONN-SMD_3P-P2.00_XUNPU_WAFER-PH2.0-3PLB
  rect 1.5x3.3 smd: 1(-2,1.65) 2(0,1.65) 3(2,1.65)
  rect 1.9x3.1 smd: 4(4.6,-1.65) 5(-4.6,-1.65)
CONN-TH_2P-P2.00_XUNPU_WAFER-PH2.0-2PLB
  rect 1.5x3.3 smd: 1(-1,1.65) 2(1,1.65)
  rect 1.9x3.1 smd: 3(3.6,-1.65) 4(-3.6,-1.65)
DC-IN-TH_EJ503A
  oval 3.8x1.6 hole 3.05x0.8: 1(-2.325,2.965) 2(-2.325,-2.965)
  oval 1.6x3.8 hole 0.8x3.05: 3(2.325,-0.635)
LED0805-R-RD
  rect 1x1.399 smd: 1(1.05,0) 2(-1.05,0)
R0402
  rect 0.566x0.54 smd: 1(-0.433,0) 2(0.433,0)
SIL-8_L3.0-W2.8-P0.65-BL-EP
  rect 0.4x0.6 smd: 1(-0.975,-1.1) 2(-0.325,-1.1) 3(0.325,-1.1) 4(0.975,-1.1) 5(0.975,1.1) 6(0.325,1.1) 7(-0.325,1.1) 8(-0.975,1.1)
  rect 1.9x1.1 smd: 9(0,0)
SOD-323_L1.8-W1.3-LS2.5-RD
  rect 1x0.75 smd: 1(-1.173,0) 2(1.173,0)
SOD-523_L1.2-W0.8-LS1.6-BI
  rect 0.6x0.4 smd: 1(-0.75,0) 2(0.75,0)
SOT-23-3_L2.9-W1.3-P1.90-LS2.4-BR
  rect 1.25x0.7 smd: 1(1,-0.95) 2(1,0.95) 3(-1,0)
SOT-89-5_L4.5-W2.5-P1.50-LS4.4-BR
  rect 1.5x0.574 smd: 1(1.698,-1.5) 3(1.698,1.5) 4(-1.698,1.5) 5(-1.698,-1.5)
  oval 3.5x1.76 smd: 2(-0.715,0)
  rect 2.209x0.574 smd: 2(1.343,0)
SW-SMD_L3.9-W3.0-P4.45
  rect 1.23x1.86 smd: 1(-2.185,0) 2(2.185,0)
USB-C-SMD_TYPE-C16PIN
  oval 1x2.1 hole 0.6x1.7: 1(-4.32,1.788) 2(4.32,1.788)
  oval 1x1.8 hole 0.6x1.4: 3(-4.32,-2.362) 4(4.32,-2.362)
  rect 0.6x1.15 smd: A1B12(-3.2,2.362) A4B9(-2.4,2.362) B1A12(3.2,2.362) B4A9(2.4,2.362)
  rect 0.3x1.15 smd: A5(-1.25,2.362) A6(-0.25,2.362) A7(0.25,2.362) A8(1.25,2.362) B5(1.75,2.362) B6(0.75,2.362) B7(-0.75,2.362) B8(-1.75,2.362)
WIRELM-SMD_ESP32-S3-WROOM-1
  rect 1.5x0.9 smd: 1(-8.75,8.895) 2(-8.75,7.625) 3(-8.75,6.355) 4(-8.75,5.085) 5(-8.75,3.815) 6(-8.75,2.545) 7(-8.75,1.275) 8(-8.75,0.005) 9(-8.75,-1.265) 10(-8.75,-2.535) 11(-8.75,-3.805) 12(-8.75,-5.075) 13(-8.75,-6.345) 14(-8.75,-7.615) 27(8.75,-7.615) 28(8.75,-6.345) 29(8.75,-5.075) 30(8.75,-3.805) 31(8.75,-2.535) 32(8.75,-1.265) 33(8.75,0.005) 34(8.75,1.275) 35(8.75,2.545) 36(8.75,3.815) 37(8.75,5.085) 38(8.75,6.355) 39(8.75,7.625) 40(8.75,8.895)
  rect 0.9x1.5 smd: 15(-6.985,-8.895) 16(-5.715,-8.895) 17(-4.445,-8.895) 18(-3.175,-8.895) 19(-1.905,-8.895) 20(-0.635,-8.895) 21(0.635,-8.895) 22(1.905,-8.895) 23(3.175,-8.895) 24(4.445,-8.895) 25(5.715,-8.895) 26(6.985,-8.865)
  rect 0.9x0.9 smd: 41(-2.9,2.575) 41(-2.9,1.175) 41(-2.9,-0.225) 41(-1.5,2.575) 41(-1.5,1.175) 41(-1.5,-0.225) 41(-0.1,2.575) 41(-0.1,1.175) 41(-0.1,-0.225)

## Nets
As in the schematic.

Pads without a net: U2 3; U6 12 15 16 17 18 23 24 25 26 28 29 30 31 32 33 34 35 36 37 38 39; U7 4 5; U8 4 5; U9 4 5; U10 4 5; U11 4 5; U12 4 5; U13 4 5; U14 4 5; U15 3 4; U16 3 4; U17 3 4; U18 3 4; USB1 1 2 3 4 A8 B8
